# EAGLE schematic Battery Button Board (EAGLE 8.0.0)
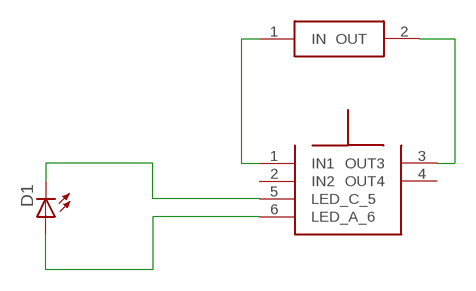
[diagram p0: schematic, sheet 1]

## Parts
D1  LED  [XH_CONNECTOR]
S1  SWITCH_CONNECTOR  [XH_CONNECTOR]
U$1  LED_TACT_SWITCH  [LED_TACT_SWITCH]

## Nets
GND: D1.2(C) U$1.5(LED_C_5)
N$1: D1.1(A) U$1.6(LED_A_6)
N$3: S1.1(IN) U$1.1(IN1)
N$4: S1.2(OUT) U$1.3(OUT3)
Unconnected: U$1.2(IN2) U$1.4(OUT4)

## Library data of the parts
D1 = thanics_robotics:LED
S1 = thanics_robotics:SWITCH_CONNECTOR
U$1 = thanics_robotics:LED_TACT_SWITCH